# Altium schematic sheet usb.SchDoc
size A2
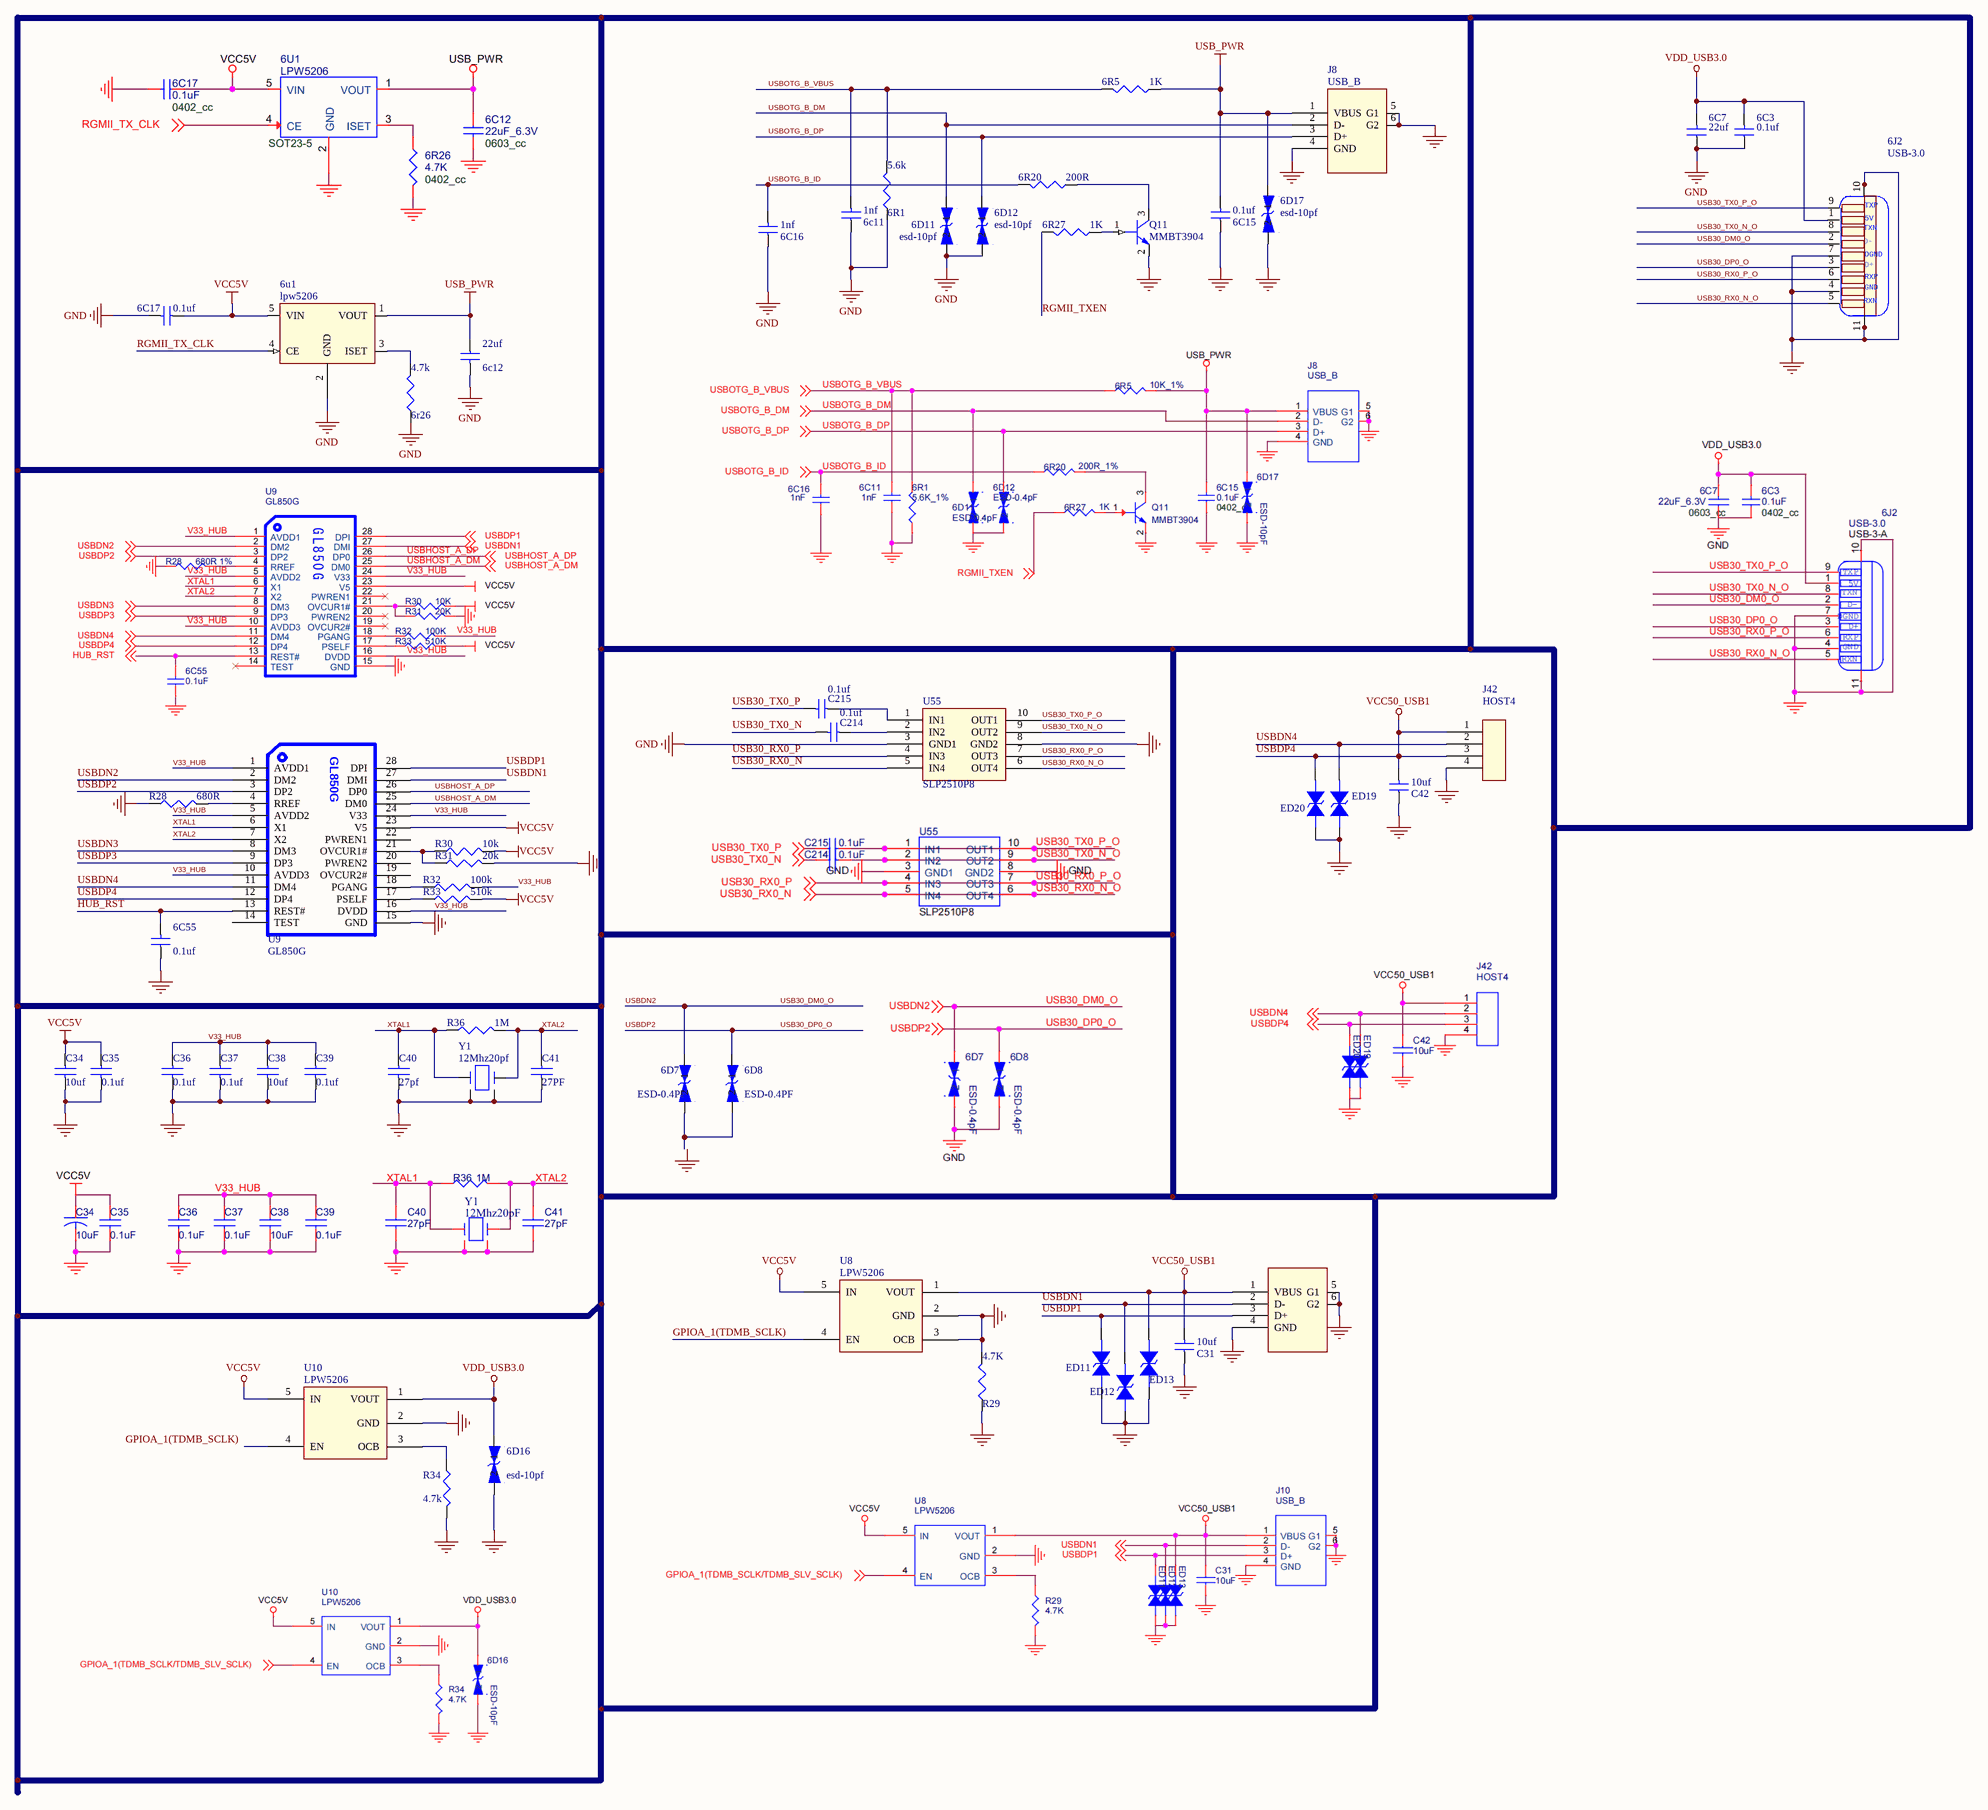
[diagram p0: usb.SchDoc]

## Parts
6C3  0.1uf  [0603C]
6C7  22uf  [0603C]
6c11  1nf  [0603C]
6c12  22uf  [0603C]
6C15  0.1uf  [0603C]
6C16  1nf  [0603C]
6C17  0.1uf  [0603C]
6C55  0.1uf  [0603C]
6D7  ESD-0.4PF
6D8  ESD-0.4PF
6D11  esd-10pf
6D12  esd-10pf
6D16  esd-10pf
6D17  esd-10pf
6J2  USB-3.0
6R1  5.6k  [R0603]
6R5  1K  [R0603]
6R20  200R  [R0603]
6r26  4.7k  [R0603]
6R27  1K  [R0603]
6u1  lpw5206  [SOT-25]
C31  10uf  [0603C]
C34  10uf
C35  0.1uf
C36  0.1uf
C37  0.1uf
C38  10uf
C39  0.1uf
C40  27pf
C41  27PF
C42  10uf  [0603C]
C214  0.1uf  [0603C]
C215  0.1uf  [0603C]
ED11  (no value)
ED12  (no value)
ED13  (no value)
ED19  (no value)
ED20  (no value)
J4  (no value)
J8  USB_B
J42  HOST4
Q11  MMBT3904
R28  680R  [R0603]
R29  4.7K  [R0603]
R30  10k  [R0603]
R31  20k  [R0603]
R32  100k  [R0603]
R33  510k  [R0603]
R34  4.7k  [R0402]
R36  1M  [R0603]
U8  LPW5206
U9  GL850G
U10  LPW5206
U55  SLP2510P8
Y1  12Mhz20pf

## Nets
GND: 6C3.1 6C7.1 6c11.1 6c12.2 6C16.1 6C17.2 6D11.2 6D12.2 6R1.1 6r26.1 6u1.2(GND) U55.3(GND1)
Net6C15_1: 6C15.1 6C55.1 6D16.2 6D17.2 6J2.4(GND) 6J2.7(DGND) 6J2.10(S1) 6J2.11(S2) C31.1 C34.2 C35.2 C36.2 C37.2 C38.2 C39.2 C40.2 C41.2 C42.1 ED11.2 ED12.2 ED13.2 ED19.2 ED20.2 J4.4(GND) J4.5(G1) J4.6(G2) J8.4(GND) J8.5(G1) J8.6(G2) J42.4 Q11.2(EMITTER) R28.1 R29.1 R29.2 R31.2 R34.2 U8.2(GND) U8.3(OCB) U9.15(GND) U10.2(GND) U55.8(GND2) Y1.2 Y1.4
USB_PWR: 6c12.1 6C15.2 6D17.1 6R5.1 6u1.1(VOUT) J8.1(VBUS)
USBDP4: C31.2 C42.2 ED13.1 ED20.1 J4.1(VBUS) J42.1 J42.3 U8.1(VOUT) U9.12(DP4)  [also labelled VCC50_USB1]
VCC5V: 6C17.1 6u1.5(VIN) C34.1 C35.1 R30.2 R33.2 U8.5(IN) U9.23(V5) U10.5(IN)
VDD_USB3.0: 6C3.2 6C7.2 6D16.1 6J2.1(VBUS) U10.1(VOUT)
GPIOA_1(TDMB_SCLK): U8.4(EN)
HUB_RST: 6C55.2 U9.13(REST#)
RGMII_TX_CLK: 6u1.4(CE)
RGMII_TXEN: 6R27.2
USB30_DM0_O: 6D7.1 6J2.2(D-) U9.2(DM2)  [also labelled USBDN2]
USB30_DP0_O: 6D8.1 6J2.3(D+) U9.3(DP2)  [also labelled USBDP2]
USB30_RX0_N: U55.5(IN4)
USB30_RX0_N_O: 6J2.5(RXN) U55.6(OUT4)
USB30_RX0_P: U55.4(IN3)
USB30_RX0_P_O: 6J2.6(RXP) U55.7(OUT3)
USB30_TX0_N: C214.2
USB30_TX0_N_O: 6J2.8(TXN) U55.9(OUT2)
USB30_TX0_P: C215.2
USB30_TX0_P_O: 6J2.9(TXP) U55.10(OUT1)
USBDN1: ED12.1 J4.2(D-) U9.27(DMI)
USBDN3: U9.8(DM3)
USBDN4: ED19.1 J42.2 U9.11(DM4)
USBDP1: ED11.1 J4.3(D+) U9.28(DPI)
USBDP3: U9.9(DP3)
USBHOST_A_DM: U9.25(DM0)
USBHOST_A_DP: U9.26(DP0)
USBOTG_B_DM: 6D11.1 J8.2(D-)
USBOTG_B_DP: 6D12.1 J8.3(D+)
USBOTG_B_ID: 6C16.2 6R20.2
USBOTG_B_VBUS: 6c11.2 6R1.2 6R5.2
V33_HUB: C36.1 C37.1 C38.1 C39.1 R32.2 U9.1(AVDD1) U9.5(AVDD2) U9.10(AVDD3) U9.16(DVDD) U9.24(V33)
XTAL1: C40.1 R36.1 U9.6(X1) Y1.1
XTAL2: C41.1 R36.2 U9.7(X2) Y1.3
Net6D7_2: 6D7.2 6D8.2
Net6R20_1: 6R20.1 Q11.3(COLLECT)
Net6r26_2: 6r26.2 6u1.3(ISET)
Net6R27_1: 6R27.1 Q11.1(BASE)
NetC214_1: C214.1 U55.2(IN2)
NetC215_1: C215.1 U55.1(IN1)
NetR28_2: R28.2 U9.4(RREF)
NetR30_1: R30.1 R31.1 U9.21(OVCUR1#)
NetR32_1: R32.1 U9.18(PGANG)
NetR33_1: R33.1 U9.17(PSELF)
NetR34_1: R34.1 U10.3(OCB)

Not connected (* = marked no-connect by the designer): U9 14(TEST) 19(OVCUR2#) 20(PWREN2) 22(PWREN1); U10 4(EN)

## Notes on the sheet
- Labels drawn without touching a wire or pin: GPIOA_1(TDMB_SCLK)
- (in symbol USB_0) 5V

## Library data of the parts
6C3 6C7 6c11 6c12 6C15-6C17 6C55 C31 C42 C214 C215 = capnp: 1R42: 8R12
6D7 6D8 6D11 6D12 6D16 6D17 = TVS DIODE
6J2 = USB_0
6R1 6R5 6R20 6r26 6R27 R28-R33 R36 = 01RES
6u1 = U_RT9701_2
C34-C41 = CAP
ED11-ED13 ED19 ED20 = DIODE BI-DIR TRIG
J4 J8 = USB_A_1
J42 = CON4
Q11 = NPN_1: J102: 1L3
R34 = RESISTOR_2
U8 U10 = SWITCH_SY6280
U9 = gl850_0
U55 = rRClamp0524P
Y1 = CRYSTAL_2